# EAGLE design mackb_breakout (EAGLE 9.6.1)
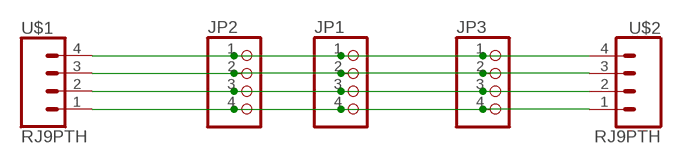
[diagram p0: schematic, sheet 1]

## Parts
JP1  PINHD-1X4  [1X04]
JP2  PINHD-1X4  [1X04]
JP3  PINHD-1X4  [1X04]
U$1  RJ9PTH  [RJ9]
U$2  RJ9PTH  [RJ9]

## Nets
N$1: JP1.1 JP2.1 JP3.1 U$1.4 U$2.4
N$2: JP1.2 JP2.2 JP3.2 U$1.3 U$2.3
N$3: JP1.3 JP2.3 JP3.3 U$1.2 U$2.2
N$8: JP1.4 JP2.4 JP3.4 U$1.1 U$2.1

## Library data of the parts
JP1-JP3 = pinhead:PINHD-1X4: PIN HEADER
U$1 U$2 = SparkFun-Retired:RJ9: This is a 4-pin connector commonly found on phone handsets. Great for simple TX/RX/PWR/GND connections. Sometime referred to as RJ9 or 4P4C. SparkFun does not currently use this on any active designs, and the connector alone has been retired. However, for more info visit here: https://www.sparkfun.com/products/retired/8694

## Net classes
1 power: width 0.178 mm

## Board
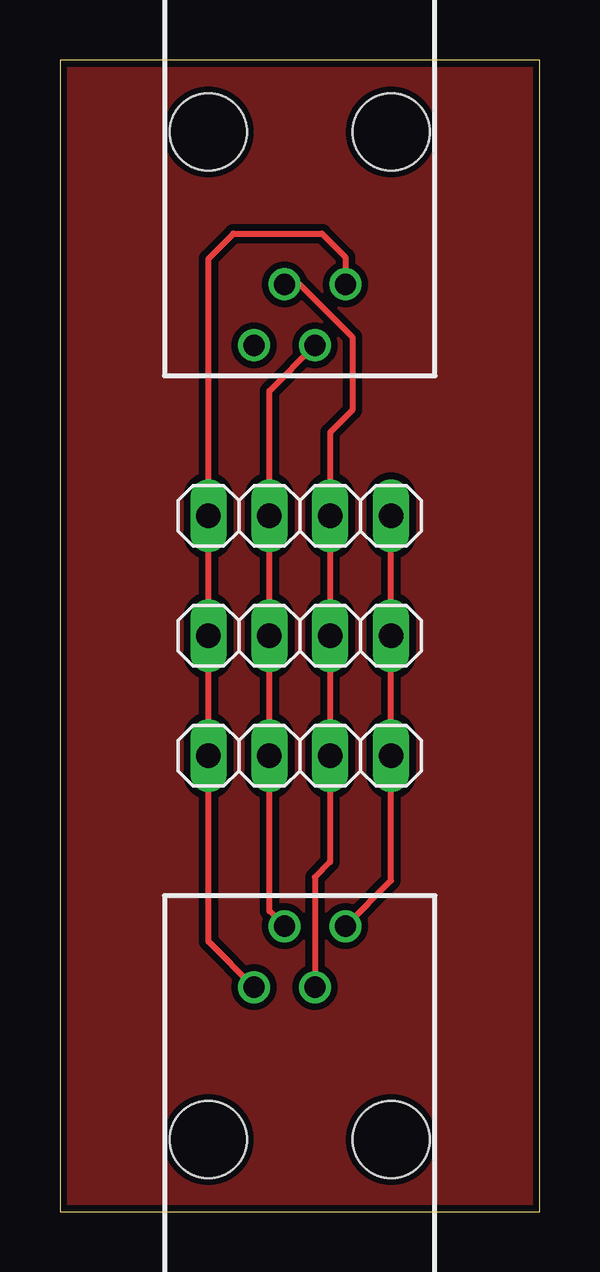
[diagram p1: board, top side]
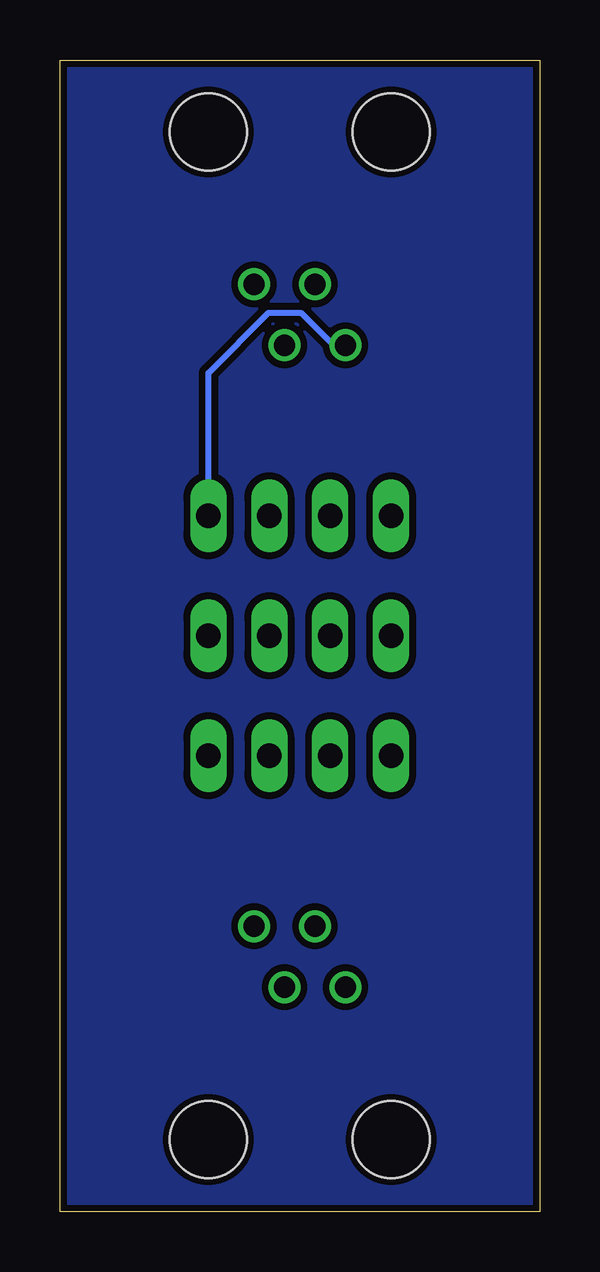
[diagram p2: board, bottom side, seen from below]

Size 20 x 48 mm. Coordinates in mm from the lower left corner, seen from the top.
Outline: 0,48 0,0 20,0 20,48 0,48
Copper layers (1*16): Top 0.035mm / dielectric 1.5mm / Bottom 0.035mm
Design rules "deku_2layer_6mil": minimum track width 6mil, minimum drill 15mil, track to track 6mil, track to pad 6mil, pad to pad 6mil, via to via 6mil, smd to smd 6mil, copper to edge 10mil, drill to drill 6mil, minimum pad ring 7mil, minimum via ring 7mil, stop-mask expansion 4mil, vias tented up to drill 25mil, thermal gap 10mil

### Footprints (pad centres in the part's own frame; a part is rotated, then mirrored left to right if it is on the bottom)
1X04 = drill 1.016 long: 1 -3.81,0; 2 -1.27,0; 3 1.27,0; 4 3.81,0
RJ9 = drill 0.889: 1 -1.905,6.35; 2 -0.635,8.89; 3 0.635,6.35; 4 1.905,8.89 | hole 3.2: -3.81,0; 3.81,0

### Placement (x,y rotation side)
JP1  10,24 180 top
JP2  10,29 180 top
JP3  10,19 180 top
U$1  10,3 0 top
U$2  10,45 180 top

### Tracks (layer width: path | path; a pad name or v marks a point on that pad's centre or on a via)
GND
  pour Top (isolate 0.279): 0,48 0,0 20,0 20,48
  pour Bottom (isolate 0.279, rank 2): 20,48 20,0 0,0 0,48
N$1
  Top 0.254: U$1.4 13.81,13.79 JP3.1 JP1.1 JP2.1
  Bottom 0.254: JP2.1 13.81,34.96 11.3,37.47 9.96,37.47 8.6,36.11 U$2.4
N$2
  Top 0.254: U$2.3 9.99,38.65 12.19,36.45 12.19,33.4 11.27,32.48 JP2.2 JP1.2 JP3.2 11.27,14.57 10.63,13.94 U$1.3
N$3
  Top 0.254: U$1.2 8.73,12.53 JP3.3 JP1.3 JP2.3 8.73,34.2 U$2.2
N$8
  Top 0.254: U$1.1 6.19,11.26 JP3.4 JP1.4 JP2.4 6.19,39.72 7.24,40.77 10.92,40.77 11.9,39.78 U$2.1